# Altium schematic sheet RAM.SchDoc
size A4
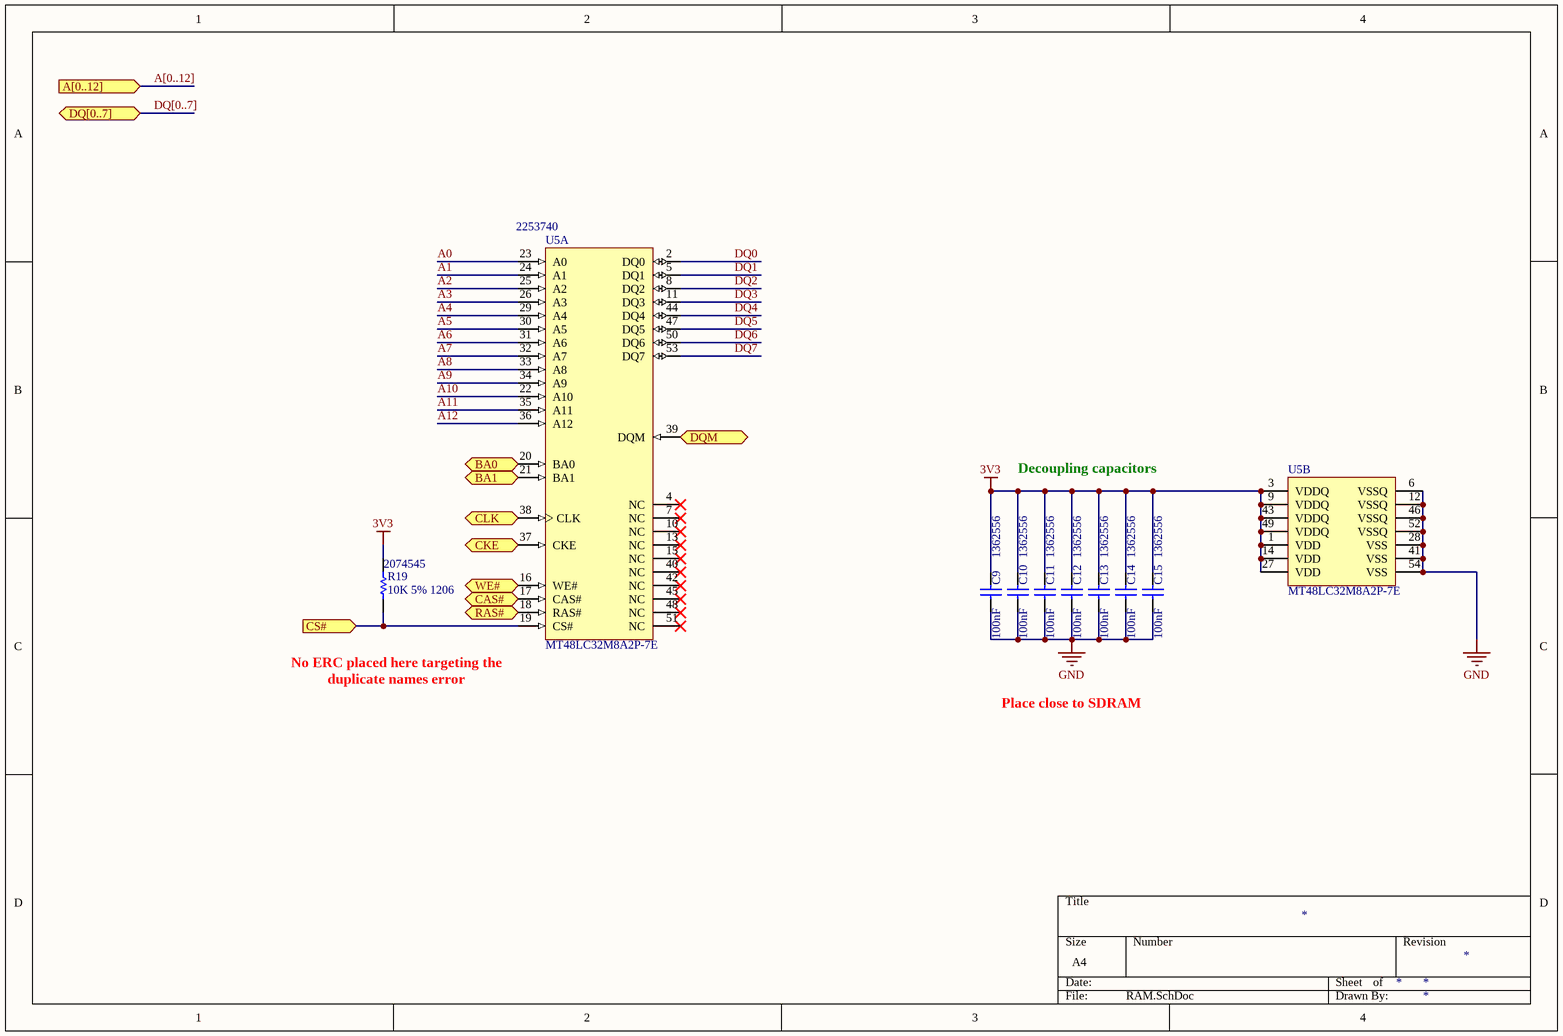
[diagram p0: RAM.SchDoc]

## Parts
C9  100nF  Supplier Part Number 1: 1362556  [CAPC0603(1608)100_N]
C10  100nF  Supplier Part Number 1: 1362556  [CAPC0603(1608)100_N]
C11  100nF  Supplier Part Number 1: 1362556  [CAPC0603(1608)100_N]
C12  100nF  Supplier Part Number 1: 1362556  [CAPC0603(1608)100_N]
C13  100nF  Supplier Part Number 1: 1362556  [CAPC0603(1608)100_N]
C14  100nF  Supplier Part Number 1: 1362556  [CAPC0603(1608)100_N]
C15  100nF  Supplier Part Number 1: 1362556  [CAPC0603(1608)100_N]
R19  10K 5% 1206  Supplier Part Number 1: 2074545  [RESC1206(3216)_M]
U5  MT48LC32M8A2P-7E  Supplier Part Number 1: 2253740  [MICT-P-54_N]  (parts A,B of 2)

## Ports
A[0..12] (in), BA0 (in), BA1 (in), CAS# (in), CKE (in), CLK (in), CS# (in), DQ[0..7] (bidir), DQM (in), RAS# (in), WE# (in)

## Nets
3V3: C9.2 C10.2 C11.2 C12.2 C13.2 C14.2 C15.2 R19.2 U5.1(VDD) U5.3(VDDQ) U5.9(VDDQ) U5.14(VDD) U5.27(VDD) U5.43(VDDQ) U5.49(VDDQ)
GND: C9.1 C10.1 C11.1 C12.1 C13.1 C14.1 C15.1 U5.6(VSSQ) U5.12(VSSQ) U5.28(VSS) U5.41(VSS) U5.46(VSSQ) U5.52(VSSQ) U5.54(VSS)
A0: U5.23(A0)
A1: U5.24(A1)
A2: U5.25(A2)
A3: U5.26(A3)
A4: U5.29(A4)
A5: U5.30(A5)
A6: U5.31(A6)
A7: U5.32(A7)
A8: U5.33(A8)
A9: U5.34(A9)
A10: U5.22(A10)
A11: U5.35(A11)
A12: U5.36(A12)
BA0: U5.20(BA0) ; port BA0
BA1: U5.21(BA1) ; port BA1
CAS#: U5.17(CAS#) ; port CAS#
CKE: U5.37(CKE) ; port CKE
CLK: U5.38(CLK) ; port CLK
CS#: R19.1 U5.19(CS#) ; port CS#
DQ0: U5.2(DQ0)
DQ1: U5.5(DQ1)
DQ2: U5.8(DQ2)
DQ3: U5.11(DQ3)
DQ4: U5.44(DQ4)
DQ5: U5.47(DQ5)
DQ6: U5.50(DQ6)
DQ7: U5.53(DQ7)
DQM: U5.39(DQM) ; port DQM
RAS#: U5.18(RAS#) ; port RAS#
WE#: U5.16(WE#) ; port WE#

Not connected (* = marked no-connect by the designer): U5 4(NC)* 7(NC)* 10(NC)* 13(NC)* 15(NC)* 40(NC)* 42(NC)* 45(NC)* 48(NC)* 51(NC)*

## Buses and harness runs
bus A[0..12] = port A[0..12]
bus DQ[0..7] = port DQ[0..7]

## Notes on the sheet
- Decoupling capacitors
- No ERC placed here targeting the duplicate names error
- Place close to SDRAM

## Library data of the parts
C9-C15 = CMP-1035-02592-1: CAP 100nF 50V ±10% 0603 (1608 Metric) Thickness 1mm SMD; Case-EIA: 0603; Case-Metric: 1608; Technology: SMT; Rated Voltage: 50 V; Max Thickness: 1 mm; Tolerance: ±10%; Value: 100nF; Supplier 1: Farnell
R19 = CMP-1014-00098-1: 10K 0.25W 5% 1206 (3216 Metric)  SMD; Manufacturer: YAGEO (PHYCOMP); Manufacturer Part Number: RC1206JR-0710KL; Value: 10000.00 Ohm; Case-Metric: 3216; Case-EIA: 1206; Power: 0.25 W; Tolerance: 5 %; Technology: SMT; RoHS: YES; ComponentLink1URL: http://www.farnell.com/datasheets/444357.pdf; ComponentLink1Description: http://www.farnell.com/datasheets/444357.pdf; ComponentLink2URL: http://www.farnell.com/cad/1539272.zip; ComponentLink2Description: http://www.farnell.com/cad/1539272.zip; Supplier 1: Farnell
U5 = CMP-0351-00096-1: 256Mb PC133 SDR SDRAM, 32Mb x 8, 7.5ns, 3.3V, 0 to 70 degC, 54-Pin TSOP, Pb-Free; Manufacturer: Micron; Clock Rate: 143 MHz; CL: CL = 2; Op. Temp.: 0C to +70C; Voltage: 3.3V; PackageDescription: 54-Pin Thin Small Outline Package, 10.16 x 22.22 mm, Pitch 0.8 mm; Density: 256Mb; ComponentLink3URL: http://www.micron.com/~/media/Documents/Products/Data%20Sheet/DRAM/128mb_x4x8x16_sdram.pdf; RoHS: Yes; Width: x8; ComponentLink3Description: Package Specification; PartNumber: MT48LC32M8A2P-7E; ComponentLink1Description: Manufacturer URL; PackageReference: MICT-P-54; ComponentLink2URL: http://www.micron.com/~/media/Documents/Products/Data%20Sheet/DRAM/256Mb_sdr.pdf; PackageVersion: Rev.Q; Depth: 32Mb; Data Rate: PC133; Cycle Time: 7.5ns; ComponentLink2Description: Datasheet; Mounting Technology: Surface Mount; ComponentLink1URL: http://www.micron.com/; DatasheetVersion: Rev.Q; PartId: 1; Supplier 1: Farnell